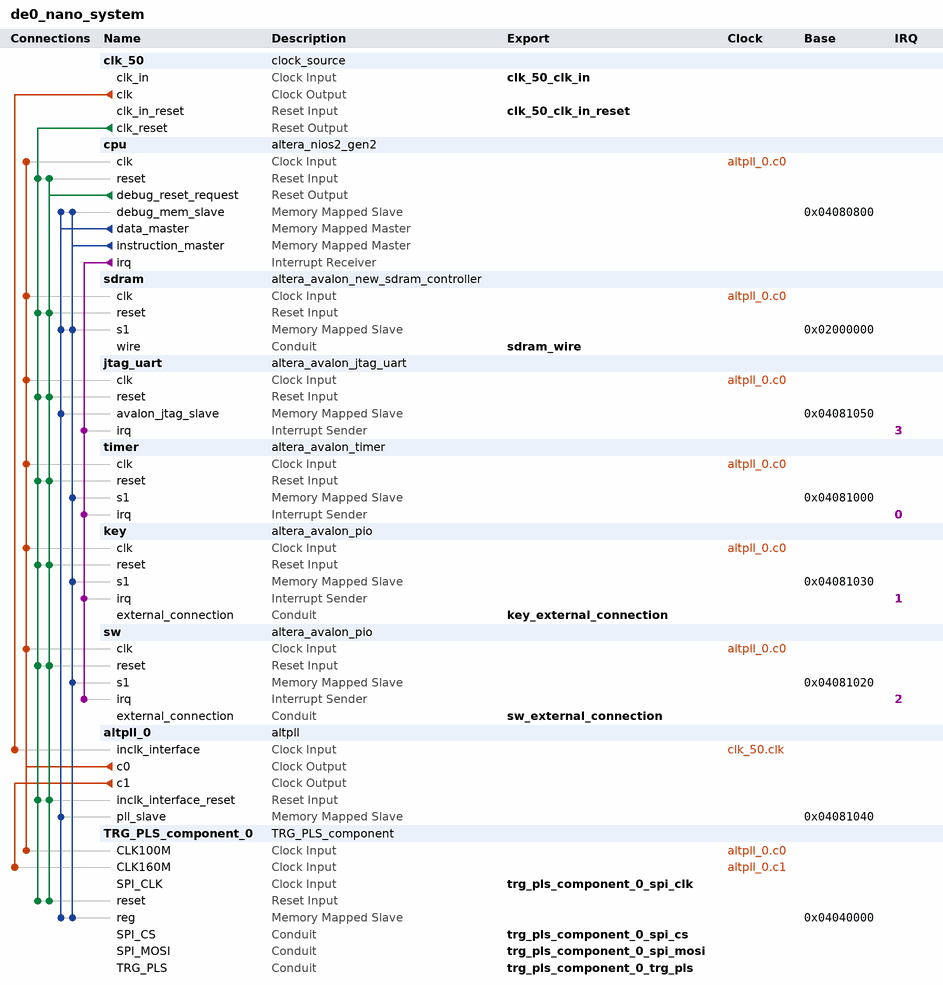
[diagram p0: system contents]
# Platform Designer (Qsys) system de0_nano_system, Cyclone IV E EP4CE22F17C6
# Parameters at their usual value, and those the tool derives, are not listed.
package require -exact qsys 18.1
create_system de0_nano_system
set_project_property DEVICE_FAMILY {Cyclone IV E}
set_project_property DEVICE EP4CE22F17C6

add_instance clk_50 clock_source 18.1
set_instance_parameter_value clk_50 clockFrequency 50000000

add_instance cpu altera_nios2_gen2 18.1
set_instance_parameter_value cpu cpuID 2080
set_instance_parameter_value cpu dcache_size 512
set_instance_parameter_value cpu exceptionSlave sdram.s1
set_instance_parameter_value cpu icache_size 1024
set_instance_parameter_value cpu impl Tiny
set_instance_parameter_value cpu resetSlave sdram.s1
set_instance_parameter_value cpu setting_activateTrace true

add_instance sdram altera_avalon_new_sdram_controller 18.1
set_instance_parameter_value sdram TAC 5.5
set_instance_parameter_value sdram TRCD 20.0
set_instance_parameter_value sdram TRP 20.0
set_instance_parameter_value sdram casLatency 3
set_instance_parameter_value sdram columnWidth 9
set_instance_parameter_value sdram dataWidth 16
set_instance_parameter_value sdram generateSimulationModel true
set_instance_parameter_value sdram model custom
set_instance_parameter_value sdram numberOfBanks 4
set_instance_parameter_value sdram numberOfChipSelects 1
set_instance_parameter_value sdram powerUpDelay 100.0
set_instance_parameter_value sdram refreshPeriod 15.625
set_instance_parameter_value sdram rowWidth 13

add_instance jtag_uart altera_avalon_jtag_uart 18.1
set_instance_parameter_value jtag_uart readBufferDepth 128
set_instance_parameter_value jtag_uart simInteractiveOptions INTERACTIVE_ASCII_OUTPUT
set_instance_parameter_value jtag_uart writeBufferDepth 128

add_instance timer altera_avalon_timer 18.1
set_instance_parameter_value timer period 1
set_instance_parameter_value timer periodUnits MSEC

add_instance key altera_avalon_pio 18.1
set_instance_parameter_value key captureEdge true
set_instance_parameter_value key direction Input
set_instance_parameter_value key edgeType FALLING
set_instance_parameter_value key generateIRQ true
set_instance_parameter_value key irqType EDGE
set_instance_parameter_value key width 2

add_instance sw altera_avalon_pio 18.1
set_instance_parameter_value sw captureEdge true
set_instance_parameter_value sw direction Input
set_instance_parameter_value sw edgeType ANY
set_instance_parameter_value sw generateIRQ true
set_instance_parameter_value sw irqType EDGE
set_instance_parameter_value sw width 4

add_instance altpll_0 altpll 18.1
set_instance_parameter_value altpll_0 CLK0_DIVIDE_BY 1
set_instance_parameter_value altpll_0 CLK0_MULTIPLY_BY 2
set_instance_parameter_value altpll_0 CLK1_DIVIDE_BY 5
set_instance_parameter_value altpll_0 CLK1_DUTY_CYCLE 50
set_instance_parameter_value altpll_0 CLK1_MULTIPLY_BY 16
set_instance_parameter_value altpll_0 CLK1_PHASE_SHIFT 0
set_instance_parameter_value altpll_0 INCLK0_INPUT_FREQUENCY 20000
set_instance_parameter_value altpll_0 PORT_ARESET PORT_USED
set_instance_parameter_value altpll_0 PORT_LOCKED PORT_USED
set_instance_parameter_value altpll_0 PORT_clk1 PORT_USED
set_instance_parameter_value altpll_0 PORT_clk2 PORT_UNUSED
set_instance_parameter_value altpll_0 PORT_clk3 PORT_UNUSED

add_instance TRG_PLS_component_0 TRG_PLS_component 4.1

# connections
add_connection altpll_0.c0 cpu.clk clock
add_connection altpll_0.c0 jtag_uart.clk clock
add_connection altpll_0.c0 key.clk clock
add_connection altpll_0.c0 sdram.clk clock
add_connection altpll_0.c0 sw.clk clock
add_connection altpll_0.c0 timer.clk clock
add_connection altpll_0.c0 TRG_PLS_component_0.CLK100M clock
add_connection altpll_0.c1 TRG_PLS_component_0.CLK160M clock
add_connection clk_50.clk altpll_0.inclk_interface clock
add_connection clk_50.clk_reset altpll_0.inclk_interface_reset reset
add_connection clk_50.clk_reset cpu.reset reset
add_connection clk_50.clk_reset jtag_uart.reset reset
add_connection clk_50.clk_reset key.reset reset
add_connection clk_50.clk_reset sdram.reset reset
add_connection clk_50.clk_reset sw.reset reset
add_connection clk_50.clk_reset timer.reset reset
add_connection clk_50.clk_reset TRG_PLS_component_0.reset reset
add_connection cpu.debug_reset_request altpll_0.inclk_interface_reset reset
add_connection cpu.debug_reset_request cpu.reset reset
add_connection cpu.debug_reset_request jtag_uart.reset reset
add_connection cpu.debug_reset_request key.reset reset
add_connection cpu.debug_reset_request sdram.reset reset
add_connection cpu.debug_reset_request sw.reset reset
add_connection cpu.debug_reset_request timer.reset reset
add_connection cpu.debug_reset_request TRG_PLS_component_0.reset reset
add_connection cpu.data_master altpll_0.pll_slave avalon
set_connection_parameter_value cpu.data_master/altpll_0.pll_slave baseAddress 0x04081040
add_connection cpu.data_master cpu.debug_mem_slave avalon
set_connection_parameter_value cpu.data_master/cpu.debug_mem_slave baseAddress 0x04080800
add_connection cpu.data_master jtag_uart.avalon_jtag_slave avalon
set_connection_parameter_value cpu.data_master/jtag_uart.avalon_jtag_slave baseAddress 0x04081050
add_connection cpu.data_master sdram.s1 avalon
set_connection_parameter_value cpu.data_master/sdram.s1 baseAddress 0x02000000
add_connection cpu.data_master TRG_PLS_component_0.reg avalon
set_connection_parameter_value cpu.data_master/TRG_PLS_component_0.reg baseAddress 0x04040000
add_connection cpu.instruction_master cpu.debug_mem_slave avalon
set_connection_parameter_value cpu.instruction_master/cpu.debug_mem_slave baseAddress 0x04080800
add_connection cpu.instruction_master key.s1 avalon
set_connection_parameter_value cpu.instruction_master/key.s1 baseAddress 0x04081030
add_connection cpu.instruction_master sdram.s1 avalon
set_connection_parameter_value cpu.instruction_master/sdram.s1 baseAddress 0x02000000
add_connection cpu.instruction_master sw.s1 avalon
set_connection_parameter_value cpu.instruction_master/sw.s1 baseAddress 0x04081020
add_connection cpu.instruction_master timer.s1 avalon
set_connection_parameter_value cpu.instruction_master/timer.s1 baseAddress 0x04081000
add_connection cpu.instruction_master TRG_PLS_component_0.reg avalon
set_connection_parameter_value cpu.instruction_master/TRG_PLS_component_0.reg baseAddress 0x04040000
add_connection cpu.irq jtag_uart.irq interrupt
set_connection_parameter_value cpu.irq/jtag_uart.irq irqNumber 3
add_connection cpu.irq key.irq interrupt
set_connection_parameter_value cpu.irq/key.irq irqNumber 1
add_connection cpu.irq sw.irq interrupt
set_connection_parameter_value cpu.irq/sw.irq irqNumber 2
add_connection cpu.irq timer.irq interrupt
set_connection_parameter_value cpu.irq/timer.irq irqNumber 0

# exported interfaces
add_interface clk_50_clk_in clock sink
set_interface_property clk_50_clk_in EXPORT_OF clk_50.clk_in
add_interface clk_50_clk_in_reset reset sink
set_interface_property clk_50_clk_in_reset EXPORT_OF clk_50.clk_in_reset
add_interface key_external_connection conduit end
set_interface_property key_external_connection EXPORT_OF key.external_connection
add_interface sdram_wire conduit end
set_interface_property sdram_wire EXPORT_OF sdram.wire
add_interface sw_external_connection conduit end
set_interface_property sw_external_connection EXPORT_OF sw.external_connection
add_interface trg_pls_component_0_spi_clk clock sink
set_interface_property trg_pls_component_0_spi_clk EXPORT_OF TRG_PLS_component_0.SPI_CLK
add_interface trg_pls_component_0_spi_cs conduit end
set_interface_property trg_pls_component_0_spi_cs EXPORT_OF TRG_PLS_component_0.SPI_CS
add_interface trg_pls_component_0_spi_mosi conduit end
set_interface_property trg_pls_component_0_spi_mosi EXPORT_OF TRG_PLS_component_0.SPI_MOSI
add_interface trg_pls_component_0_trg_pls conduit end
set_interface_property trg_pls_component_0_trg_pls EXPORT_OF TRG_PLS_component_0.TRG_PLS

set_interconnect_requirement {$system} qsys_mm.clockCrossingAdapter HANDSHAKE
set_interconnect_requirement {$system} qsys_mm.maxAdditionalLatency 0

save_system de0_nano_system.qsys
